# EAGLE design logic (EAGLE 9.2.1)
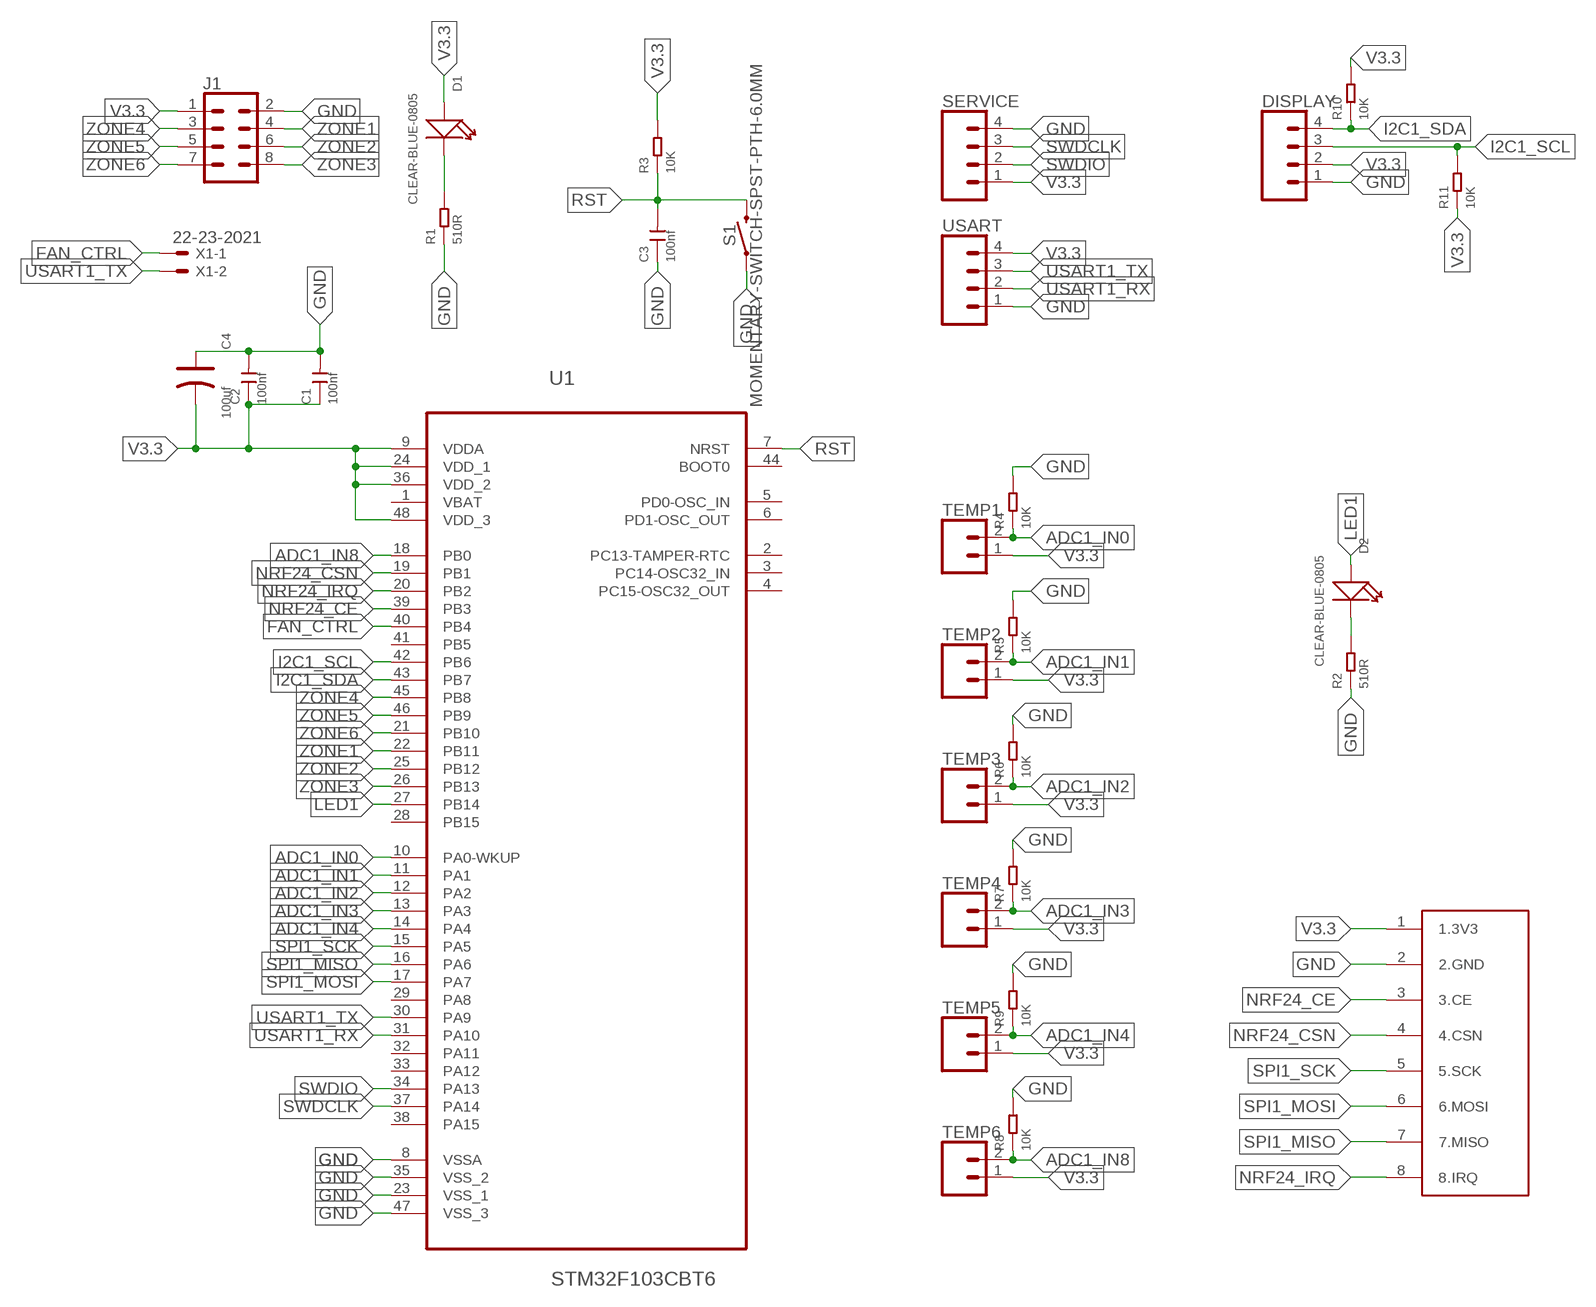
[diagram p0: schematic, sheet 1]

## Parts
C1  100nf  CERAMIC-100NF-50V-10%-X7R(0805)  [C0805]
C2  100nf  CERAMIC-100NF-50V-10%-X7R(0805)  [C0805]
C3  100nf  CERAMIC-100NF-50V-10%-X7R(0805)  [C0805]
C4  100uf  TANTALUM-SMD-100UF-10V(AVX-B)  [AVX-B]
D1  CLEAR-BLUE-0805  SMD-LED-CLEAR-BLUE(0805)  [LED-0805]
D2  CLEAR-BLUE-0805  SMD-LED-CLEAR-BLUE(0805)  [LED-0805]
DISPLAY  CONN_04  [1X04]
J1  CONN_04X2  [2X4]
R1  510R  SMD-RES-510R-5%-1/10W(0603)  [R0603]
R2  510R  SMD-RES-510R-5%-1/10W(0603)  [R0603]
R3  10K  SMD-RES-10K-1%-1/8W(0805)  [R0805]
R4  10K  SMD-RES-10K-1%-1/8W(0805)  [R0805]
R5  10K  SMD-RES-10K-1%-1/8W(0805)  [R0805]
R6  10K  SMD-RES-10K-1%-1/8W(0805)  [R0805]
R7  10K  SMD-RES-10K-1%-1/8W(0805)  [R0805]
R8  10K  SMD-RES-10K-1%-1/8W(0805)  [R0805]
R9  10K  SMD-RES-10K-1%-1/8W(0805)  [R0805]
R10  10K  SMD-RES-10K-1%-1/8W(0805)  [R0805]
R11  10K  SMD-RES-10K-1%-1/8W(0805)  [R0805]
S1  MOMENTARY-SWITCH-SPST-PTH-6.0MM  [TACTILE_SWITCH_PTH_6.0MM]
SERVICE  CONN_04  [1X04]
TEMP1  CONN_02  [1X02]
TEMP2  CONN_02  [1X02]
TEMP3  CONN_02  [1X02]
TEMP4  CONN_02  [1X02]
TEMP5  CONN_02  [1X02]
TEMP6  CONN_02  [1X02]
U1  STM32F103CBT6  [QFP50P900X900X160-48N]
U$2  NRF24L01+  [NRF24L01+]
USART  CONN_04  [1X04]
X1  22-23-2021  [22-23-2021]

## Nets
ADC1_IN0: R4.1 TEMP1.2 U1.10(PA0-WKUP)
ADC1_IN1: R5.1 TEMP2.2 U1.11(PA1)
ADC1_IN2: R6.1 TEMP3.2 U1.12(PA2)
ADC1_IN3: R7.1 TEMP4.2 U1.13(PA3)
ADC1_IN4: R9.1 TEMP5.2 U1.14(PA4)
ADC1_IN8: R8.1 TEMP6.2 U1.18(PB0)
FAN_CTRL: U1.40(PB4) X1.1
GND: C1.2 C2.2 C3.1 C4.+ DISPLAY.1 J1.2 R1.1 R2.1 R4.2 R5.2 R6.2 R7.2 R8.2 R9.2 S1.1 SERVICE.4 U1.8(VSSA) U1.23(VSS_1) U1.35(VSS_2) U1.47(VSS_3) U$2.2(2.GND) USART.1
I2C1_SCL: DISPLAY.3 R11.2 U1.42(PB6)
I2C1_SDA: DISPLAY.4 R10.1 U1.43(PB7)
LED1: D2.+ U1.27(PB14)
N$2: D1.- R1.2
N$4: D2.- R2.2
NRF24_CE: U1.39(PB3) U$2.3(3.CE)
NRF24_CSN: U1.19(PB1) U$2.4(4.CSN)
NRF24_IRQ: U1.20(PB2) U$2.8(8.IRQ)
RST: C3.2 R3.1 S1.3 U1.7(NRST)
SPI1_MISO: U1.16(PA6) U$2.7(7.MISO)
SPI1_MOSI: U1.17(PA7) U$2.6(6.MOSI)
SPI1_SCK: U1.15(PA5) U$2.5(5.SCK)
SWDCLK: SERVICE.3 U1.37(PA14)
SWDIO: SERVICE.2 U1.34(PA13)
USART1_RX: U1.31(PA10) USART.2
USART1_TX: U1.30(PA9) USART.3 X1.2
V3.3: C1.1 C2.1 C4.- D1.+ DISPLAY.2 J1.1 R3.2 R10.2 R11.1 SERVICE.1 TEMP1.1 TEMP2.1 TEMP3.1 TEMP4.1 TEMP5.1 TEMP6.1 U1.9(VDDA) U1.24(VDD_1) U1.36(VDD_2) U1.48(VDD_3) U$2.1(1.3V3) USART.4
ZONE1: J1.4 U1.22(PB11)
ZONE2: J1.6 U1.25(PB12)
ZONE3: J1.8 U1.26(PB13)
ZONE4: J1.3 U1.45(PB8)
ZONE5: J1.5 U1.46(PB9)
ZONE6: J1.7 U1.21(PB10)
Unconnected: U1.1(VBAT) U1.2(PC13-TAMPER-RTC) U1.3(PC14-OSC32_IN) U1.4(PC15-OSC32_OUT) U1.5(PD0-OSC_IN) U1.6(PD1-OSC_OUT) U1.28(PB15) U1.29(PA8) U1.33(PA12) U1.38(PA15) U1.41(PB5) U1.44(BOOT0)

## Power pins joined to a net without a drawn wire
PA11: U1.32(PA11)

## Library data of the parts
C1-C3 = Seeed-Capacitor:CERAMIC-100NF-50V-10%-X7R(0805): 302010165; MPN: CC0805KRX7R9BB104
C4 = Seeed-Capacitor:TANTALUM-SMD-100UF-10V(AVX-B): 302020015; MPN: TAJB107M010#NJ
D1 D2 = Seeed-LED:SMD-LED-CLEAR-BLUE(0805): 304090061; MPN: EL-17-215/BHC-AN1P2/3T
DISPLAY SERVICE USART = SparkFun-Connectors:CONN_04: Multi connection point. Often used as Generic Header-pin footprint for 0.1 inch spaced/style header connections On any of the 0.1 inch spaced packages, you can populate with these: Break Away Headers - Straight <https://www.sparkfun.com/products/116> (PRT-00116) Break Away Male Headers - Right Angle <https://www.sparkfun.com/products/553> (PRT-00553) Female Headers <https://www.sparkfun.com/products/115> (PRT-00115) Break Away Headers - Machine Pin <https://www.sparkfun.com/products/117> (PRT-00117) Break Away Female Headers - Swiss Machine Pin <https://www.sparkfun.com/products/743> (PRT-00743) For SCREWTERMINALS and SPRING TERMINALS visit here: Screw Terimnals on SparkFun.com <https://www.sparkfun.com/search/results?term=Screw+Terminals> (5mm/3.5mm/2.54mm spacing) This device is also useful as a general connection point to wire up your design to another part of your project. Our various solder wires solder well into these plated through hole pads. Hook-Up Wire - Assortment (Stranded, 22 AWG) <https://www.sparkfun.com/products/11375> (PRT-11375) Hook-Up Wire - Assortment (Solid Core, 22 AWG) <https://www.sparkfun.com/products/11367> (PRT-11367) View the entire wire category on our website here <https://www.sparkfun.com/categories/141> Special notes: Molex polarized connector foot print use with SKU : PRT-08231 with associated crimp pins and housings. 1MM SMD Version SKU: PRT-10208; PROD_ID: CONN-09696
J1 = SparkFun-Connectors:CONN_04X2: Multi connection point. Often used as Generic Header-pin footprint for 0.1 inch spaced/style header connections On any of the 0.1 inch spaced packages, you can populate with these: Break Away Headers - Straight <https://www.sparkfun.com/products/116> (PRT-00116) Break Away Male Headers - Right Angle <https://www.sparkfun.com/products/553> (PRT-00553) Female Headers <https://www.sparkfun.com/products/115> (PRT-00115) Break Away Headers - Machine Pin <https://www.sparkfun.com/products/117> (PRT-00117) Break Away Female Headers - Swiss Machine Pin <https://www.sparkfun.com/products/743> (PRT-00743)
R1 R2 = Seeed-Resistor:SMD-RES-510R-5%-1/10W(0603): 301010157; MPN: RC0603JR-07510RL
R3-R11 = Seeed-Resistor:SMD-RES-10K-1%-1/8W(0805): 301010361; MPN: RC0805FR-0710KL
S1 = SparkFun-Switches:MOMENTARY-SWITCH-SPST: Momentary Switch (Pushbutton) - SPST Normally-open (NO) SPST momentary switches (buttons, pushbuttons). Variants PTH-12MM - 12mm square, through-hole Momentary Pushbutton Switch - 12mm Square <https://www.sparkfun.com/products/9190> (COM-09190) PTH-6.0MM, PTH-6.0MM-KIT - 6.0mm square, through-hole Mini Pushbutton Switch <https://www.sparkfun.com/products/97> (COM-00097) KIT package intended for soldering kit's - only one side of pads' copper is exposed. PTH-RIGHT-ANGLE-KIT - Right-angle, through-hole Right Angle Tactile Button <https://www.sparkfun.com/products/10791> - Used on SparkFun BigTime Watch Kit <https://www.sparkfun.com/products/11734> SMD-12MM - 12mm square, surface-mount Tactile Button - SMD (12mm) <https://www.sparkfun.com/products/12993> (COM-12993) Used on SparkFun PicoBoard <https://www.sparkfun.com/products/11888> SMD-4.5MM - 4.5mm Square Trackball Switch Used on SparkFun Blackberry Trackballer Breakout <https://www.sparkfun.com/products/13169> SMD-4.6MMX2.8MM - 4.60mm x 2.80mm, surface mount Used on SparkFun SAMD21 Mini Breakout <https://www.sparkfun.com/products/13664> SMD-5.2MM, SMD-5.2-REDUNDANT - 5.2mm square, surface-mount Mini Pushbutton Switch - SMD <https://www.sparkfun.com/products/8720> (COM-08720) Used on Arduino Pro Mini <https://www.sparkfun.com/products/11114> REDUNDANT package connects both switch circuits together SMD-6.0X3.5MM - 6.0 x 3.5mm, surface mount Momentary Reset Switch SMD <https://www.sparkfun.com/products/8229> (COM-08229) SMD-6.2MM-TALL - 6.2mm square, surface mount Tactile Button - SMD (6mm) <https://www.sparkfun.com/products/12992> Used on SparkFun Digital Sandbox <https://www.sparkfun.com/products/12651> SMD-RIGHT-ANGLE - Right-angle, surface mount Used on SparkFun Block for Intel® Edison - Arduino <https://www.sparkfun.com/products/13036>; PROD_ID: SWCH-08441; SF_SKU: COM-00097
TEMP1-TEMP6 = SparkFun-Connectors:CONN_02: Multi connection point. Often used as Generic Header-pin footprint for 0.1 inch spaced/style header connections On any of the 0.1 inch spaced packages, you can populate with these: Break Away Headers - Straight <https://www.sparkfun.com/products/116> (PRT-00116) Break Away Male Headers - Right Angle <https://www.sparkfun.com/products/553> (PRT-00553) Female Headers <https://www.sparkfun.com/products/115> (PRT-00115) Break Away Headers - Machine Pin <https://www.sparkfun.com/products/117> (PRT-00117) Break Away Female Headers - Swiss Machine Pin <https://www.sparkfun.com/products/743> (PRT-00743) For SCREWTERMINALS and SPRING TERMINALS visit here: Screw Terimnals on SparkFun.com <https://www.sparkfun.com/search/results?term=Screw+Terminals> (5mm/3.5mm/2.54mm spacing) This device is also useful as a general connection point to wire up your design to another part of your project. Our various solder wires solder well into these plated through hole pads. Hook-Up Wire - Assortment (Stranded, 22 AWG) <https://www.sparkfun.com/products/11375> (PRT-11375) Hook-Up Wire - Assortment (Solid Core, 22 AWG) <https://www.sparkfun.com/products/11367> (PRT-11367) View the entire wire category on our website here <https://www.sparkfun.com/categories/141> Special notes: Molex polarized connector foot print use with: PRT-08233 with associated crimp pins and housings. 2.54_SCREWTERM for use with PRT-10571. 3.5mm Screw Terminal footprints for PRT-08084 5mm Screw Terminal footprints for use with PRT-08432
U1 = ST Microelctronics_By_element14_Batch_1:STM32F103CBT6: Medium-density performance line ARM-based 32-bit MCU; MPN: STM32F103CBT6; OC_FARNELL: 1606327; OC_NEWARK: 11N8296; PACKAGE: QFP-48; SUPPLIER: STMICROELECTRONICS
U$2 = NRF24l01+:NRF24L01+
X1 = con-molex:22-23-2021: .100" (2.54mm) Center Header - 2 Pin; MF: MOLEX; MPN: 22-23-2021; OC_FARNELL: 1462926; OC_NEWARK: 25C3832

## Net classes
0 default: width 0.203 mm, clearance 0.203 mm
1 220v: width 0.508 mm, clearance 0.254 mm

## Board
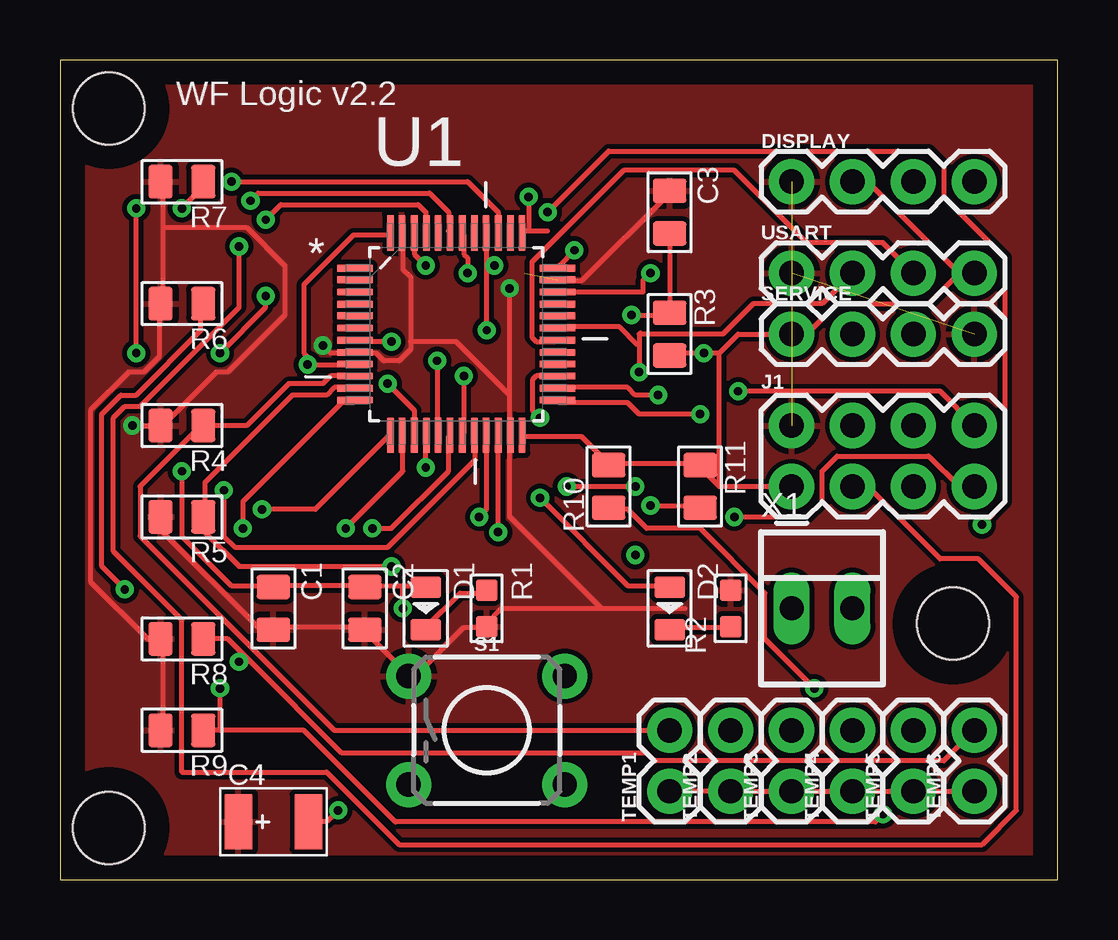
[diagram p1: board, top side]
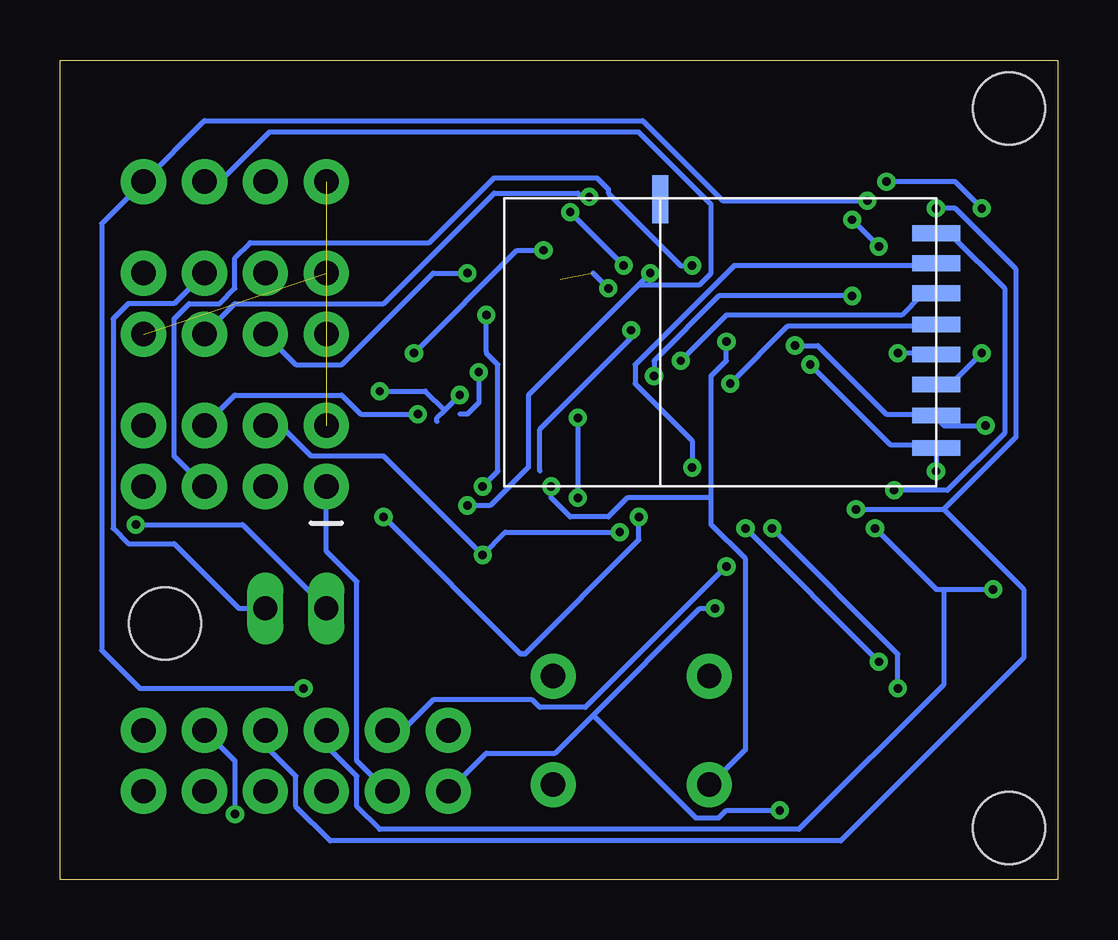
[diagram p2: board, bottom side, seen from below]

Size 41.58 x 34.15 mm. Coordinates in mm from the lower left corner, seen from the top.
Outline: 0,0 41.58,0 41.58,34.15 0,34.15 0,0
Copper layers (1*16): Top 0.035mm / dielectric 1.5mm / Bottom 0.035mm
Design rules "default": minimum track width 6mil, minimum drill 0.35mm, track to track 6mil, track to pad 6mil, pad to pad 6mil, via to via 6mil, smd to smd 6mil, copper to edge 40mil, drill to drill 6mil, minimum pad ring 10mil, minimum via ring 8mil, stop-mask expansion 4mil, vias tented up to drill 0mil, thermal gap 10mil
Holes 3 mm at 2.03,32.13 2.03,2.16 37.21,10.67

### Footprints (pad centres in the part's own frame; a part is rotated, then mirrored left to right if it is on the bottom)
C0805 = smd 1.397 x 1.016: 1 0,0.889; 2 0,-0.889
AVX-B = smd 1.143 x 2.286: + -1.46,0; - 1.46,0
LED-0805 = smd 0.889 x 1.27: + -0.889,0; - 0.889,0
1X04 = drill 1.016 pad 1.88: 1 0,0; 2 2.54,0; 3 5.08,0; 4 7.62,0
2X4 = drill 1.016 pad 1.88: 1 -3.81,-1.27; 2 -3.81,1.27; 3 -1.27,-1.27; 4 -1.27,1.27; 5 1.27,-1.27; 6 1.27,1.27; 7 3.81,-1.27; 8 3.81,1.27
R0603 = smd 0.889 x 0.889: 1 0,0.762; 2 0,-0.762
R0805 = smd 1.397 x 1.016: 1 0,0.889; 2 0,-0.889
TACTILE_SWITCH_PTH_6.0MM = drill 1.016 pad 1.88: 1 -3.251,2.261; 2 3.251,2.261; 3 -3.251,-2.261; 4 3.251,-2.261
1X02 = drill 1.016 pad 1.88: 1 0,0; 2 2.54,0
QFP50P900X900X160-48N = smd 1.473 x 0.279: 1 -4.216,2.743; 2 -4.216,2.261; 3 -4.216,1.753; 4 -4.216,1.245; 5 -4.216,0.762; 6 -4.216,0.254; 7 -4.216,-0.254; 8 -4.216,-0.762; 9 -4.216,-1.245; 10 -4.216,-1.753; 11 -4.216,-2.261; 12 -4.216,-2.743; 25 4.216,-2.743; 26 4.216,-2.261; 27 4.216,-1.753; 28 4.216,-1.245; 29 4.216,-0.762; 30 4.216,-0.254; 31 4.216,0.254; 32 4.216,0.762; 33 4.216,1.245; 34 4.216,1.753; 35 4.216,2.261; 36 4.216,2.743 | smd 0.279 x 1.473: 13 -2.743,-4.216; 14 -2.261,-4.216; 15 -1.753,-4.216; 16 -1.245,-4.216; 17 -0.762,-4.216; 18 -0.254,-4.216; 19 0.254,-4.216; 20 0.762,-4.216; 21 1.245,-4.216; 22 1.753,-4.216; 23 2.261,-4.216; 24 2.743,-4.216; 37 2.743,4.216; 38 2.261,4.216; 39 1.753,4.216; 40 1.245,4.216; 41 0.762,4.216; 42 0.254,4.216; 43 -0.254,4.216; 44 -0.762,4.216; 45 -1.245,4.216; 46 -1.753,4.216; 47 -2.261,4.216; 48 -2.743,4.216
NRF24L01+ = smd 0.65 x 2: 1 1.6,0; 2 2.95,0; 3 4.25,0; 4 5.5,0; 5 6.75,0; 6 8.05,0; 7 9.3,0; 8 10.55,0 | smd 2 x 0.65: 9 11.96,11.49
22-23-2021 = drill 1 long: 1 -1.27,0; 2 1.27,0

### Placement (x,y rotation side)
C1  8.89,11.3 0 top
C2  12.7,11.3 0 top
C3  25.4,27.81 0 top
C4  8.89,2.41 0 top
D1  15.24,11.3 270 top
D2  25.4,11.3 270 top
DISPLAY  30.48,29.08 0 top
J1  34.29,17.65 0 top
R1  17.78,11.3 180 top
R2  27.94,11.3 0 top
R3  25.4,22.73 0 top
R4  5.08,18.92 270 top
R5  5.08,15.11 270 top
R6  5.08,24 270 top
R7  5.08,29.08 270 top
R8  5.08,10.03 270 top
R9  5.08,6.22 270 top
R10  22.86,16.38 180 top
R11  26.67,16.38 0 top
S1  17.78,6.22 0 top
SERVICE  30.48,22.73 0 top
TEMP1  25.4,3.68 90 top
TEMP2  27.94,3.68 90 top
TEMP3  30.48,3.68 90 top
TEMP4  33.02,3.68 90 top
TEMP5  35.56,3.68 90 top
TEMP6  38.1,3.68 90 top
U1  16.51,22.73 0 top
U$2  5.08,16.38 90 bottom
USART  30.48,25.27 0 top
X1  31.75,11.3 0 top

### Tracks (layer width: path | path; a pad name or v marks a point on that pad's centre or on a via)
ADC1_IN0
  Top 0.203: U1.10 12.22,20.99 11.27,20.99 10.95,20.67 9.53,20.67 7.78,18.92 R4.1 5.87,18.92 3.33,16.38 3.33,14.32 11.43,6.22 TEMP1.2
ADC1_IN1  (via drill 0.35)
  Top 0.203: 6.03,15.11 6.03,16.54 9.68,20.19 11.11,20.19 11.43,20.51 12.22,20.51 U1.11 | v13.81,13.05 7.46,13.05 6.03,14.48 6.03,15.11 | 6.03,15.11 R5.1
  Bottom 0.203: TEMP2.2 27.3,6.22 26.04,7.49 21.91,7.49 21.59,7.18 19.68,7.18 v13.81,13.05
ADC1_IN2  (via drill 0.35)
  Top 0.203: v2.7,12.1 1.75,13.05 1.75,19.4 2.54,20.19 3.17,20.19 5.87,22.89 5.87,24 R6.1 | v7.62,14.64 7.62,15.75 11.75,19.88 12.22,19.88 U1.12
  Bottom 0.203: 4.76,12.1 5.08,12.1 v7.62,14.64 | 4.76,12.1 v2.7,12.1 | TEMP3.2 30.48,5.59 29.21,4.32 29.21,3.05 28.26,2.1 10.79,2.1 4.76,8.13 4.76,12.1
ADC1_IN3  (via drill 0.35)
  Top 0.203: v5.08,27.97 5.87,28.77 5.87,29.08 R7.1 | v8.41,15.43 10.64,15.43 13.65,18.45 U1.13
  Bottom 0.203: v5.08,27.97 4.29,27.97 1.75,25.43 1.75,18.45 4.76,15.43 | v8.41,15.43 4.76,15.43 | TEMP4.2 33.02,5.59 31.75,4.32 31.75,3.05 30.32,1.62 9.05,1.62 1.43,9.24 1.43,12.1 4.76,15.43
ADC1_IN4  (via drill 0.35)
  Top 0.203: 6.67,6.22 10.16,6.22 13.97,2.41 33.97,2.41 v34.29,2.73 | 6.67,6.22 R9.1 | v11.91,14.64 14.29,17.02 14.29,18.45 U1.14 | 6.67,6.22 v6.67,7.97
  Bottom 0.203: v34.29,2.73 34.29,4.95 TEMP5.2 | v11.91,14.64 6.67,9.4 v6.67,7.97
ADC1_IN8  (via drill 0.35)
  Top 0.203: R8.1 6.99,10.03 7.94,9.08 | 7.94,9.08 11.75,5.27 24.45,5.27 24.77,4.95 36.83,4.95 TEMP6.2 | v13.02,14.64 13.81,14.64 16.19,17.02 16.19,18.45 U1.18 | 7.94,9.08 v7.46,9.08
  Bottom 0.203: v7.46,9.08 v13.02,14.64
FAN_CTRL  (via drill 0.35)
  Top 0.203: v17.78,22.89 17.78,25.59 | 17.78,25.59 17.78,26.86 U1.40 | v38.42,14.8 39.37,15.75 39.37,25.91 36.83,28.45 36.83,29.72 36.2,30.35 22.86,30.35 v20.32,27.81 | 17.78,25.59 v18.1,25.59
  Bottom 0.203: v17.78,22.89 17.78,22.57 21.59,18.76 21.59,17.02 | X1.1 33.97,14.8 v38.42,14.8 | v18.1,25.59 v20.32,27.81
GND  (via drill 0.35)  (4 unrouted)
  Top 0.203: U1.35 20.8,24.96 21.75,24.96 25.4,28.61 C3.1 | R9.2 4.29,6.22 4.29,10.03 R8.2 3.65,10.03 1.27,12.41 1.27,19.56 2.86,21.15 3.49,21.15 4.13,21.78 4.13,24 R6.2 4.29,24 4.29,27.18 | v3.02,18.92 R4.2 4.29,18.92 6.51,21.15 6.99,21.15 9.37,23.53 9.37,25.59 7.78,27.18 4.29,27.18 | 4.29,27.18 4.29,29.08 R7.2 | 8.89,10.51 12.7,10.51 C2.2 12.7,10.35 14.45,8.6 S1.1 14.61,8.6 14.92,8.6 16.83,10.51 17.78,10.51 R1.1 17.78,10.67 18.41,11.3 22.54,11.3 | 8.89,10.51 8.26,10.51 4.29,14.48 4.29,15.11 R5.2 | 8.89,10.51 C1.2 | 14.61,22.41 14.61,25.11 14.29,25.43 14.29,26.86 U1.47 | 14.61,22.41 14.61,22.1 14.13,21.62 13.49,21.62 13.18,21.94 12.38,21.94 U1.8 12.22,21.94 11.27,21.94 v10.95,22.26 | 22.54,11.3 26.04,11.3 | 27.94,11.94 R2.1 | 22.54,11.3 18.73,15.11 18.73,18.45 U1.23 18.73,18.6 18.73,20.19 | 14.61,22.41 16.51,22.41 18.73,20.19 | 18.73,20.19 v18.73,24.64
  Bottom 0.203: v3.02,18.92 4.76,18.92 5.08,19.24 U$2.2 5.08,19.4 7.14,19.4 10,22.26 v10.95,22.26 | v18.73,24.64 19.37,25.27
  pour Top: 0,34.16 41.91,34.16 41.91,-0.13 0,-0.13
I2C1_SCL  (via drill 0.35)
  Top 0.203: v24.61,15.59 26.67,15.59 R11.2 | v16.99,25.27 16.99,25.91 16.83,26.07 16.83,26.86 U1.42
  Bottom 0.203: v24.61,15.59 23.65,15.59 22.07,17.18 22.07,20.19 17.46,24.8 | v16.99,25.27 17.46,24.8 | 17.46,24.8 14.92,24.8 14.45,25.27 14.45,28.13 17.46,31.15 32.86,31.15 34.92,29.08 DISPLAY.3
I2C1_SDA  (via drill 0.35)
  Top 0.203: R10.1 22.86,15.43 23.65,15.43 24.45,14.64 26.67,14.64 29.37,11.94 29.37,10.03 v31.43,7.97 | v7.94,28.29 8.26,28.61 15.4,28.61 16.19,27.81 16.19,27.02 U1.43
  Bottom 0.203: v7.94,28.29 13.97,28.29 17.3,31.62 35.56,31.62 DISPLAY.4 39.85,27.34 39.85,9.56 38.26,7.97 v31.43,7.97
LED1  (via drill 0.35)
  Top 0.203: v20,15.91 23.65,12.26 25.4,12.26 D2.+ | v20,19.24 19.68,19.56 19.68,20.83 19.84,20.99 20.64,20.99 U1.27
  Bottom 0.203: v20,19.24 v20,15.91
N$2
  Top 0.203: R1.2 17.78,11.94 16.67,11.94 15.24,10.51 D1.-
N$4
  Top 0.203: R2.2 27.94,10.51 25.4,10.51 D2.-
NRF24_CE  (via drill 0.35)
  Top 0.203: v7.14,29.08 16.99,29.08 18.26,27.81 18.26,27.02 U1.39 | v3.17,21.94 v3.17,27.97
  Bottom 0.203: v7.14,29.08 4.29,29.08 v3.17,27.97 | v3.17,21.94 4.45,20.67 5.08,20.67 U$2.3
NRF24_CSN  (via drill 0.35)
  Top 0.203: v16.83,20.99 16.83,18.6 U1.19 | v8.57,24.32 8.57,23.84 v6.67,21.94
  Bottom 0.203: v16.83,20.99 16.83,21.62 14.13,24.32 v8.57,24.32 | v6.67,21.94 5.08,21.94 U$2.4
NRF24_IRQ  (via drill 0.35)
  Top 0.203: v6.83,16.22 6.83,14.32 7.3,13.84 13.65,13.84 17.3,17.49 17.3,18.45 U1.20
  Bottom 0.203: v6.83,16.22 4.6,16.22 2.22,18.6 2.22,24.64 4.45,26.86 5.08,26.86 U$2.8
RST  (via drill 0.35)
  Top 0.203: C3.2 R3.1 25.4,23.53 v23.81,23.53 | v13.81,22.41 12.38,22.41 U1.7 | v21.11,16.38 v23.97,16.38
  Bottom 0.203: v13.81,22.41 13.81,21.62 14.45,20.99 14.45,15.91 | 14.45,15.91 14.45,14.8 13.02,13.37 13.02,5.43 14.45,4 S1.3 | v23.97,16.38 23.34,17.02 23.34,21.46 23.81,21.94 23.82,22.02 23.82,23.49 v23.81,23.53 | v21.11,16.38 21.11,15.91 20.32,15.11 18.73,15.11 17.94,15.91 14.45,15.91
SPI1_MISO  (via drill 0.35)
  Top 0.203: v15.24,17.18 15.24,18.45 U1.16
  Bottom 0.203: v15.24,17.18 15.24,18.29 17.62,20.67 17.62,21.46 13.49,25.59 5.08,25.59 U$2.7
SPI1_MOSI  (via drill 0.35)
  Top 0.203: v15.72,21.62 15.72,18.6 U1.17
  Bottom 0.203: v15.72,21.62 13.81,23.53 6.51,23.53 5.71,24.32 5.08,24.32 U$2.6
SPI1_SCK  (via drill 0.35)
  Top 0.203: v13.65,20.67 14.76,19.56 14.76,18.6 U1.15
  Bottom 0.203: v13.65,20.67 11.27,23.05 5.08,23.05 U$2.5
SWDCLK  (via drill 0.35)
  Top 0.203: 20.32,27.02 19.53,27.02 | 19.53,27.02 19.37,27.02 U1.37 | v19.53,28.45 19.53,27.02
  Bottom 0.203: v19.53,28.45 19.84,28.45 20,28.61 23.5,28.61 28.1,24 34.29,24 SERVICE.3
SWDIO  (via drill 0.35)
  Top 0.203: U1.34 20.8,24.48 24.29,24.48 24.29,24.96 v24.61,25.27
  Bottom 0.203: v24.61,25.27 26.04,25.27 29.84,21.46 31.75,21.46 SERVICE.2
USART1_RX  (via drill 0.35)
  Top 0.203: 20.8,23.05 U1.31 20.88,23.04 23.32,23.04 24.08,22.28 24.13,22.28 | 24.13,22.73 24.13,22.28 | 24.13,22.28 v24.13,21.15 | 24.18,22.78 24.13,22.73 | 24.13,22.73 27.62,22.73 28.89,24 31.75,24 USART.2
  Bottom 0.203: 24.92,19.4 24.61,19.4 24.13,19.88 v24.13,21.15
USART1_TX
  Top 0.203: U1.30 20.64,22.41 19.84,22.41 19.68,22.57 19.66,22.63 19.66,25.73 19.68,25.75 23.5,29.56 28.1,29.56 31.11,26.54 34.29,26.54 USART.3
  Bottom 0.203: X1.2 34.13,11.3 36.83,14 38.73,14 39.37,14.64 39.37,23.37 38.73,24 36.83,24 USART.3
V3.3  (via drill 0.35)
  Top 0.203: 12.7,12.26 14.29,12.26 | 14.29,12.26 15.24,12.26 D1.+ | 12.7,12.26 8.89,12.26 | 12.7,12.26 C2.1 | 10.48,21.62 10.16,21.94 10.16,24.8 12.22,26.86 13.65,26.86 U1.48 | 10.48,21.62 10.64,21.46 12.22,21.46 U1.9 | 10.48,21.62 v10.32,21.46 | 8.89,12.26 7.14,12.26 5.08,14.32 v5.08,17.02 | 8.89,12.26 C1.1 | 27.46,21.94 v26.83,21.94 25.4,21.94 R3.2 | 22.86,17.34 26.67,17.34 R11.1 26.67,17.18 27.46,16.38 | 22.86,17.34 21.75,18.45 19.37,18.45 U1.24 | 22.86,17.34 R10.2 | 27.46,16.38 27.46,21.94 | TEMP1.1 TEMP2.1 TEMP3.1 TEMP4.1 TEMP5.1 TEMP6.1 | v14.29,11.3 14.29,12.26 | C4.- 11.11,2.41 v11.59,2.89 | 37.47,25.27 33.66,29.08 DISPLAY.2 | v21.43,26.23 20.8,25.59 U1.36 | 27.46,16.38 J1.1 | 27.46,21.94 28.26,22.73 SERVICE.1 31.11,22.73 32.38,24 36.2,24 37.47,25.27 | 37.47,25.27 USART.4
  Bottom 0.203: v10.32,21.46 6.99,18.13 5.08,18.13 U$2.1 v5.08,17.02 | v14.29,11.3 14.92,11.3 19.37,6.86 | 19.37,6.86 20.95,5.27 23.81,5.27 TEMP1.1 | v11.59,2.89 13.81,2.89 14.13,2.57 15.08,2.57 19.37,6.86 | v21.43,26.23 22.54,26.23 v26.83,21.94 | J1.1 30.48,13.68 29.21,12.41 29.21,4.95 TEMP2.1
ZONE1  (via drill 0.35)
  Top 0.203: v18.26,14.48 18.26,18.45 U1.22
  Bottom 0.203: v18.26,14.48 23.02,14.48 v23.97,13.53 28.1,17.65 31.11,17.65 32.38,18.92 J1.4
ZONE2  (via drill 0.35)
  Top 0.203: v26.67,19.4 24.13,19.4 23.65,19.88 20.8,19.88 U1.25
  Bottom 0.203: v26.67,19.4 29.05,19.4 29.84,20.19 34.29,20.19 J1.6
ZONE3  (via drill 0.35)
  Top 0.203: v24.92,20.19 23.97,20.19 23.65,20.51 20.8,20.51 U1.26 | v28.26,20.35 36.67,20.35 J1.8
  Bottom 0.203: 25.56,19.56 25.88,19.24 25.88,19.08 | 25.56,19.56 v24.92,20.19 | 25.56,19.56 26.35,20.35 v28.26,20.35
ZONE4  (via drill 0.35)
  Top 0.203: v8.57,27.49 9.21,28.13 14.92,28.13 15.24,27.81 15.24,27.02 U1.45 | v7.46,26.38 7.46,23.84 3.33,19.72 2.7,19.72 2.22,19.24 2.22,13.68 5.08,10.83 5.08,4.48 11.11,4.48 14.13,1.46 38.42,1.46 39.85,2.89 39.85,11.78 38.26,13.37 36.67,13.37 33.66,16.38 J1.3
  Bottom 0.203: v7.46,26.38 v8.57,27.49
ZONE5  (via drill 0.35)
  Top 0.203: v15.24,25.59 14.76,26.07 14.76,26.86 U1.46
  Bottom 0.203: v15.24,25.59 15.72,25.59 18.73,28.61 18.73,28.77 19.21,29.24 23.5,29.24 26.19,26.54 33.66,26.54 34.29,25.91 34.29,24.64 34.92,24 36.2,24 36.83,23.37 36.83,17.65 J1.5
ZONE6  (via drill 0.35)
  Top 0.203: v17.46,15.11 17.78,15.43 17.78,18.45 U1.21 | J1.7 37.47,16.38 36.2,17.65 32.38,17.65 31.75,17.02 31.75,15.75 31.11,15.11 v28.1,15.11
  Bottom 0.203: v17.46,15.11 17.46,14.16 22.23,9.4 22.3,9.42 22.38,9.4 v28.1,15.11

### Text on the board
tNames: WF Logic v2.2